# Altium schematic sheet Power.SchDoc
size A3; DrawnBy: Davut Beyazkaya; SheetNumber: 1; SheetTotal: 3; SPICEModelCacheTCAMPDML: <root> / <DocumentId>TCAMPDML</DocumentId> / <CacheFrame Number="0"> / <Model Name="3014_158301227" Kind="CKT"> / <Text>************************************************** / * Manufacturer:           Wurth Elektronik / * Kinds:                  SMT White Top view PLCC / * Matchcode:              WL-SWTP / * Library Type:           LTspice / * Version:                rev22a / * Created/modified by:    Ella / * Date and Time:          2022-03-02 / * Team:                   eiSos EDA Service / * Contact:                libraries@we-online.com / ************************************************** / * Copyright(C) 2022 WÃ¼rth Elektronik eiSos GmbH &amp; Co. KG / * All Rights Reserved. / ************************************************** / * Disclaimer: While WÃ¼rth Elektronik eiSos has made every reasonable effort to ensure the accuracy / * of the simulation models provided, WÃ¼rth Elektronik eiSos does not guarantee the exemption of error on / * the simulation models, nor does WÃ¼rth Elektronik eiSos guarantee that the simulation model is current. / * WÃ¼rth Elektronik eiSos reserves the right to make any adjustments at any time without notice. / * WÃ¼rth Elektronik eiSos expressly disclaims all implied warranties regarding this simulation model. / ************************************************** / .subckt 3014_158301227  1  2 / D1 1 2 led / .MODEL led D / + IS=91.819E-12 / + N=4.0378 / + RS=11.199E-6 / + IKF=1.1025E-6 / + CJO=1.0000E-12 / + M=.3333 / + VJ=.75 / + BV=5 / + IBV=5.00E-6 / + TT=5.0000E-9 / .ends</Text> / </Model> / <Model Name="1260_744771115_15u" Kind="CKT"> / <Text>******* / .subckt 1260_744771115_15u 1 2 / Rp 1 2 13381 / Cp 1 2 6.382p / Rs 1 N3 0.022 / L1 N3 2 12.996u / .ends 1260_744771115_15u</Text> / </Model> / </CacheFrame> / </root>
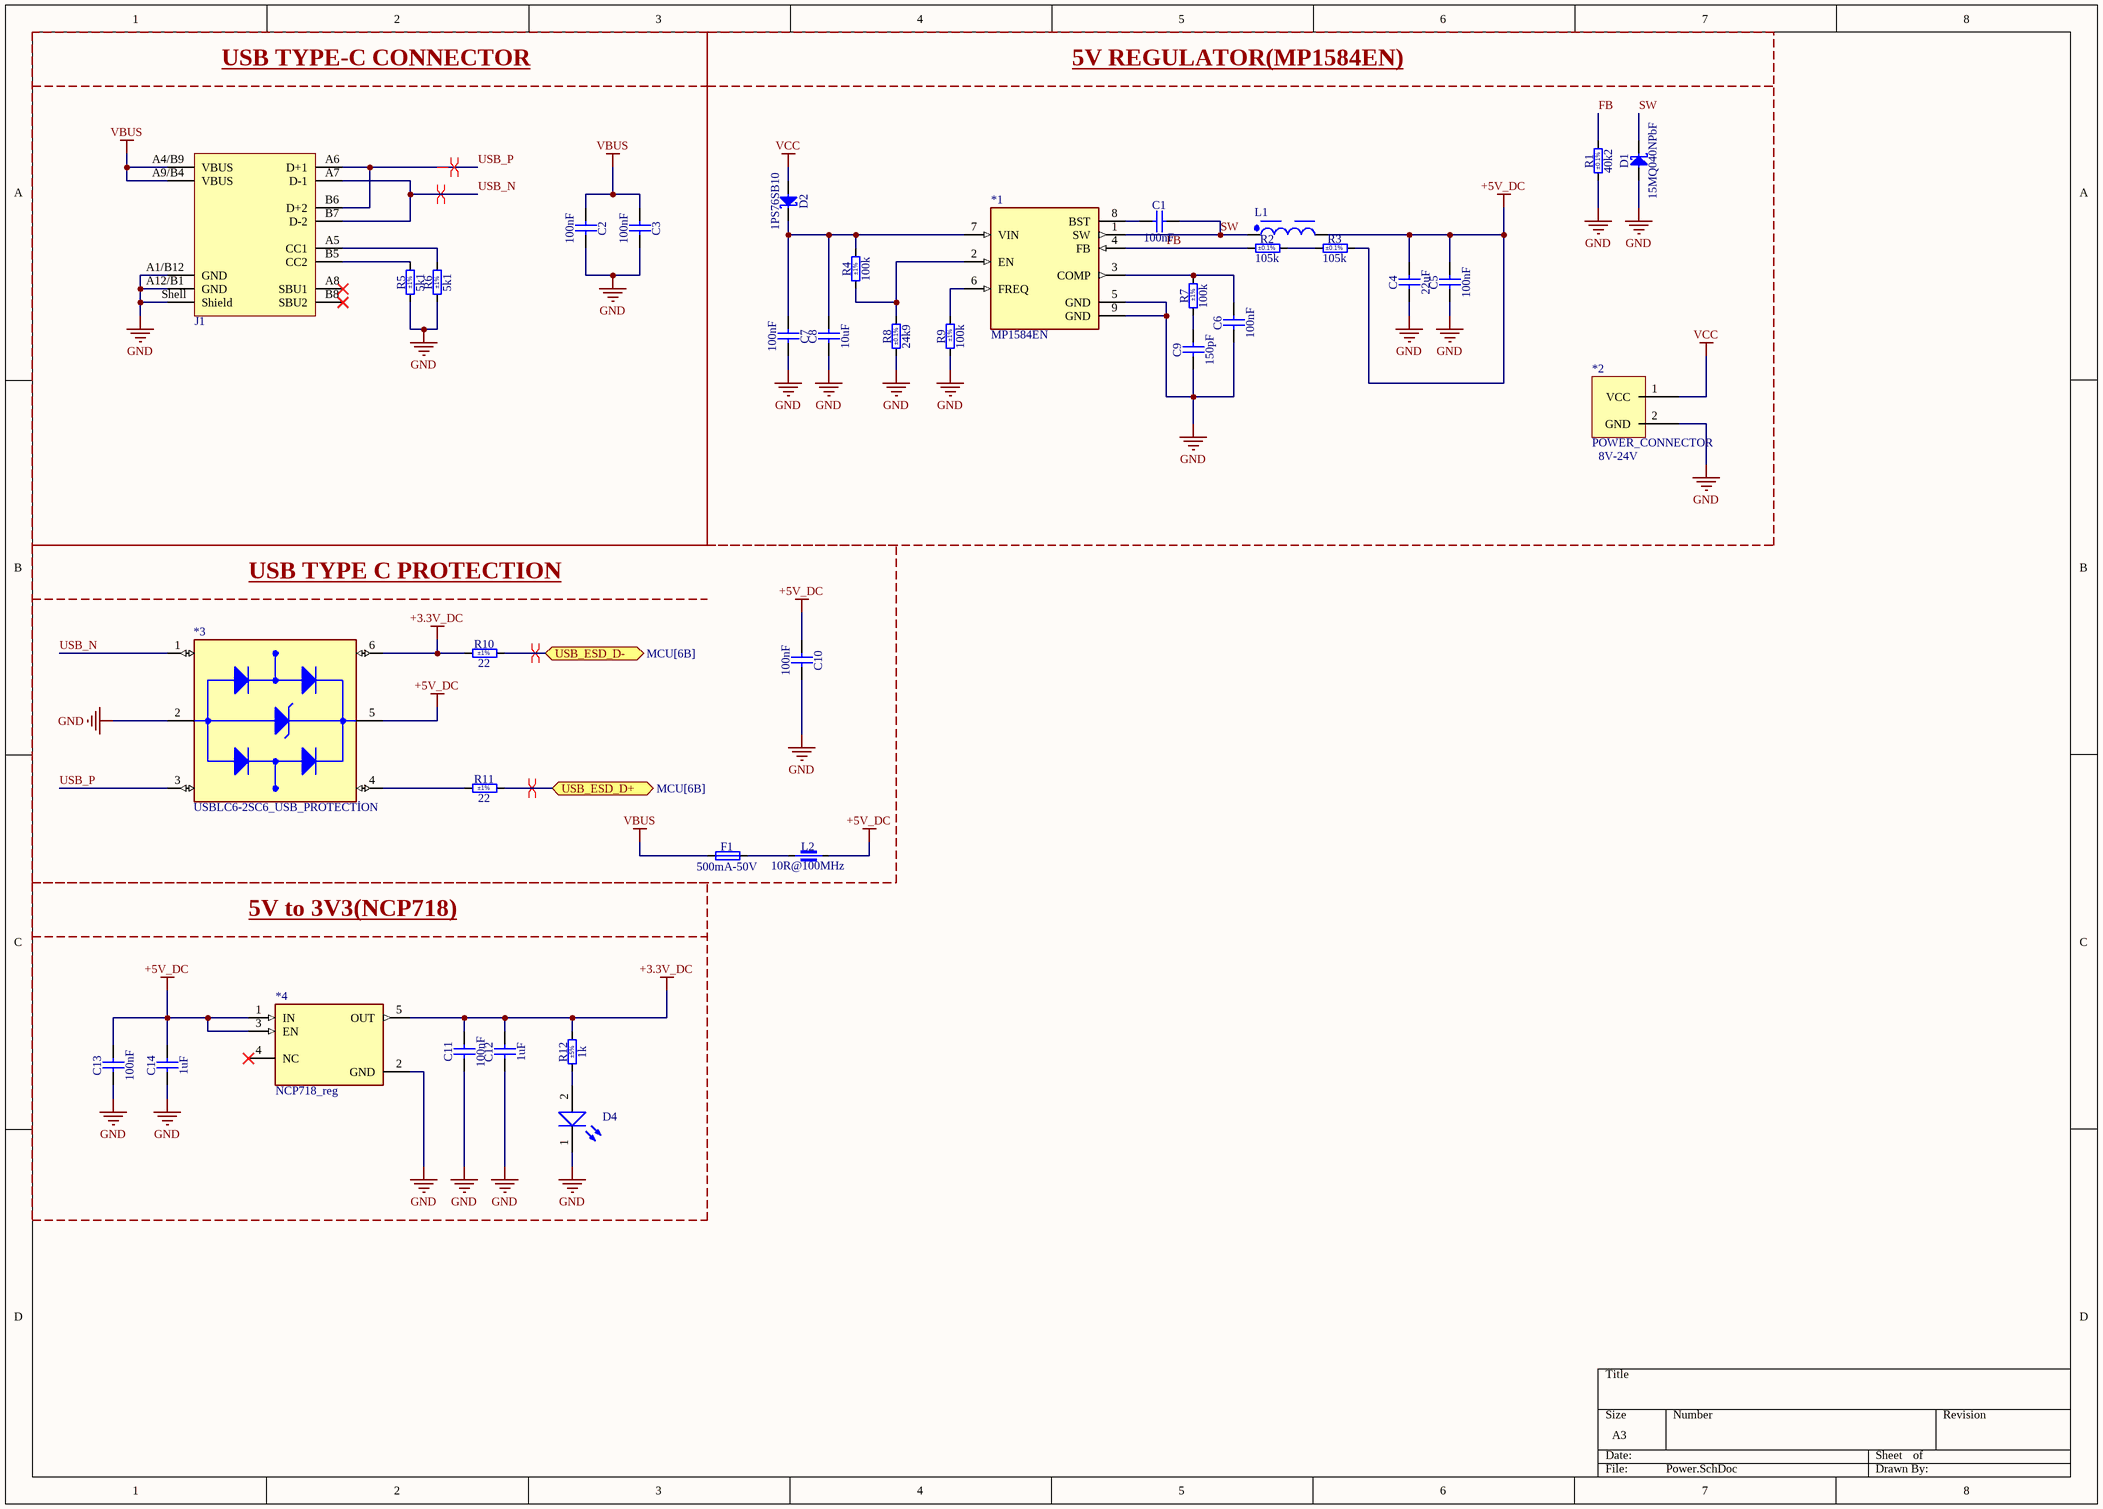
[diagram p0: Power.SchDoc]

## Parts
*1  MP1584EN  [MP1584EN]
*2  POWER_CONNECTOR  [POWER_CONNECTOR_lion_batt]
*3  USBLC6-2SC6_USB_PROTECTİON  [USBLC6-2SC6_USB_PROTECTION]
*4  NCP718_reg  [NCP718_reg]
C1  100nF  [CAPC2012X135N]
C2  100nF  [CAPC2012X135N]
C3  100nF  [CAPC2012X135N]
C4  22uF  [CAPC2012X135N]
C5  100nF  [CAPC2012X135N]
C6  100nF  [CAPC2012X135N]
C7  100nF  [CAPC2012X135N]
C8  10uF  [CAPC2012X145N]
C9  150pF  [CAPC2012X135N]
C10  100nF  [CAPC2012X135N]
C11  100nF  [CAPC2012X135N]
C12  1uF  [CAPC2012X140N]
C13  100nF  [CAPC2012X135N]
C14  1uF  [CAPC2012X140N]
D1  15MQ040NPbF  [DIOM5027X244N]
D2  1PS76SB10  [SOD2512X110N]
D4  Sunrise, 3V, 120°  [WL-SWTP_3014_L3W1.4H0.8]  (value not drawn)
F1  500mA-50V  [FUSC_BOURNS_SF-0603F]
J1  629722000214  [629722000214]  (value not drawn)
L1  15uH, 4.2A  [WE-PD_1260]  (value not drawn)
L2  10R@100MHz  [INDC1608X95N]
R1  40k2  Tolerance: ±0.1%  [RESC2012X60N]
R2  105k  Tolerance: ±0.1%  [RESC2012X60N]
R3  105k  Tolerance: ±0.1%  [RESC2012X60N]
R4  100k  Tolerance: ±1%  [RESC2012X60N]
R5  5k1  Tolerance: ±1%  [RESC2012X60N]
R6  5k1  Tolerance: ±1%  [RESC2012X60N]
R7  100k  Tolerance: ±1%  [RESC2012X60N]
R8  24k9  Tolerance: ±0.1%  [RESC2012X60N]
R9  100k  Tolerance: ±1%  [RESC2012X60N]
R10  22  Tolerance: ±1%  [RESC2012X60N]
R11  22  Tolerance: ±1%  [RESC2012X60N]
R12  1k  Tolerance: ±5%  [RESC2012X60N]

## Blocks framed on the sheet
USB TYPE-C CONNECTOR: C2 C3 J1 R5 R6
5V REGULATOR(MP1584EN): *1 *2 C1 C4-C9 D1 D2 L1 R1-R4 R7-R9
USB TYPE C PROTECTION: *3 C10 F1 L2 R10 R11
5V to 3V3(NCP718): *4 C11-C14 D4 R12

## Ports
USB_ESD_D+ (bidir, see MCU[6B]), USB_ESD_D- (bidir, see MCU[6B])

## Nets
+3.3V_DC: *3.6(I/O1_OUT) *4.5(OUT) C11.2 C12.2 R10.1 R12.2
+5V_DC: *3.5(VBUS) *4.1(IN) *4.3(EN) C4.2 C5.2 C10.1 C13.2 C14.2 L1.2 L2.2 R3.2
GND: *1.5(GND) *1.9(GND) *2.2(GND) *3.2(GND) *4.2(GND) C2.2 C3.2 C4.1 C5.1 C6.1 C7.2 C8.1 C9.1 C10.2 C11.1 C12.1 C13.1 C14.1 D1.2(A) D4.1(K) J1.A1/B12(GND) J1.A12/B1(GND) J1.Shell(Shield) R1.1 R5.1 R6.1 R8.1 R9.1
VBUS: C2.1 C3.1 F1.1 J1.A4/B9(VBUS) J1.A9/B4(VBUS)
VCC: *2.1(VCC) D2.2(A)
FB: *1.4(FB) R1.2 R2.1
SW: *1.1(SW) C1.2 D1.1(C) L1.1
USB_ESD_D+: R11.2 ; port USB_ESD_D+
USB_ESD_D-: R10.2 ; port USB_ESD_D-
USB_N: *3.1(I/O1_IN) J1.A7(D-1) J1.B7(D-2)
USB_P: *3.3(I/O2_IN) J1.A6(D+1) J1.B6(D+2)
Net*1_2: *1.2(EN) R4.1 R8.2
Net*1_3: *1.3(COMP) C6.2 R7.2
Net*1_6: *1.6(FREQ) R9.2
Net*1_7: *1.7(VIN) C7.1 C8.2 D2.1(C) R4.2
Net*1_8: *1.8(BST) C1.1
Net*3_4: *3.4(I/O2_OUT) R11.1
NetC9_2: C9.2 R7.1
NetD4_2: D4.2(A) R12.1
NetF1_2: F1.2 L2.1
NetJ1_A5: J1.A5(CC1) R6.2
NetJ1_B5: J1.B5(CC2) R5.2
NetR2_2: R2.2 R3.1

Not connected (* = marked no-connect by the designer): *4 4(NC)*; J1 A8(SBU1)* B8(SBU2)*

## Layout directives
differential pair: USB_ESD_D+, USB_ESD_D-, USB_N, USB_P

## Notes on the sheet
- (near *2) 8V-24V

## Library data of the parts
*2 = POWER_CONNECTOR_lion_batt
C1-C3 C5-C7 C10 C11 C13 = CC0805_100NF_50V_10%_X7R: Non-polarised capacitor; Part Description: SMD Multilayer Chip Ceramic Capacitor; Manufacturer: GENERIC; Manufacturer1 Part Number: C2012X7R1H104K085; Voltage: 50V; TC: X7R; Tolerance: ±10%; Part Number: CC0805_100NF_50V_10%_X7R; Component Kind: Standard; Component Type: Standard; Pin Count: 2; Value: 100nF; Status: None; Manufacturer Part Number: CC0805_100NF_50V_10%_X7R; Case: 0805; Mounted: Yes; Socket: No; SMD: Yes; Sense: No; Manufacturer1 Example: TDK; Manufacturer1 ComponentHeight: 1mm; HelpURL: \\cern.ch\dfs\Applications\Altium\Datasheets\CC0805_X7R_TDK_C.pdf; Author: CERN DEM JLC; CreateDate: 3.12.2007; LatestRevisionDate: 22.04.2015
C4 = CC0805_22UF_16V_10%_X5R: Non-polarised capacitor; Part Description: SMD Multilayer Chip Ceramic Capacitor; Manufacturer: GENERIC; Manufacturer1 Part Number: C2012X5R1C226KT; Voltage: 16V; TC: X5R; Tolerance: ±10%; Part Number: CC0805_22UF_16V_10%_X5R; Component Kind: Standard; Component Type: Standard; Pin Count: 2; Value: 22uF; Status: Preferred; Manufacturer Part Number: CC0805_22UF_16V_10%_X5R; Case: 0805; Mounted: Yes; Socket: No; SMD: Yes; Sense: No; Manufacturer1 Example: TDK; Manufacturer1 ComponentHeight: 1.35mm; HelpURL: \\cern.ch\dfs\Applications\Altium\Datasheets\CC0805_X5R_TDK_C.pdf; Author: CERN DEM JLC; CreateDate: 25.10.2012; LatestRevisionDate: 25.10.2012
C8 = CC0805_10UF_25V_10%_X5R_YUDEN_TMK212BBJ106KGHT: Non-polarised capacitor; Part Description: SMD Multilayer Chip Ceramic Capacitor (High Dielectric Type) for Automotive / Industrial Applications; Manufacturer: TAIYO YUDEN; Voltage: 25V; TC: X5R; Tolerance: ±10%; Part Number: CC0805_10UF_25V_10%_X5R_YUDEN_TMK212BBJ106KGHT; Component Kind: Standard; Component Type: Standard; Pin Count: 2; Value: 10uF; Status: Not Recommended; Manufacturer Part Number: TMK212BBJ106KGHT; Case: 0805; Mounted: Yes; Socket: No; SMD: Yes; Sense: No; ComponentHeight: 1.45mm; HelpURL: \\cern.ch\dfs\Applications\Altium\Datasheets\CC0805_TAIYO-YUDEN_TMK212BBJ106KGHT.pdf; Author: CERN DEM JLC; CreateDate: 23.01.2018; LatestRevisionDate: 23.01.2018
C9 = CC0805_150PF_50V_5%_C0G: Non-polarised capacitor; Part Description: SMD Multilayer Chip Ceramic Capacitor; Manufacturer: GENERIC; Manufacturer1 Part Number: C0805C151J5GACTU; Voltage: 50V; TC: C0G/NP0; Tolerance: ±5%; Part Number: CC0805_150PF_50V_5%_C0G; Component Kind: Standard; Component Type: Standard; Pin Count: 2; Value: 150pF; Status: Preferred; Manufacturer Part Number: CC0805_150PF_50V_5%_C0G; Case: 0805; Mounted: Yes; Socket: No; SMD: Yes; Sense: No; Manufacturer1 Example: KEMET; Manufacturer1 ComponentHeight: 0.88mm; HelpURL: \\cern.ch\dfs\Applications\Altium\Datasheets\CC0805_C0G_KEMET_(Commercial Grade).pdf; Author: CERN DEM JLC; CreateDate: 3.12.2007; LatestRevisionDate: 22.04.2015
C12 C14 = CC0805_1UF_35V_20%_X7R: Non-polarised capacitor; Part Description: SMD Multilayer Chip Ceramic Capacitor; Manufacturer: GENERIC; Manufacturer1 Part Number: GMK212B7105MG-T; Voltage: 35V; TC: X7R; Tolerance: ±20%; Part Number: CC0805_1UF_35V_20%_X7R; Component Kind: Standard; Component Type: Standard; Pin Count: 2; Value: 1uF; Status: Not Recommended; Manufacturer Part Number: CC0805_1UF_35V_20%_X7R; Case: 0805; Mounted: Yes; Socket: No; SMD: Yes; Sense: No; Manufacturer1 Example: TAIYO YUDEN; Manufacturer1 ComponentHeight: 1.35mm; HelpURL: \\cern.ch\dfs\Applications\Altium\Datasheets\CC0805_X7R_TAIYO-YUDEN_HIGH-VALUE.pdf; Author: CERN DEM JLC; CreateDate: 22.06.2011; LatestRevisionDate: 22.06.2011
D1 = 15MQ040NPbF: Schottky Diode; Part Description: Schottky Rectifier; Manufacturer: VISHAY INTERTECHNOLOGY, INC.; Voltage: 40V; Power: 3A; PressFit: No; Bonding: No; Part Number: 15MQ040NPbF; Component Kind: Standard; Component Type: Standard; Device: 15MQ040NPbF; PackageDescription: DO-214-AC/SMA  Molded Diode, Body 5.0x2.7mm, IPC Medium Density; Status: Obsolete; Manufacturer Part Number: 15MQ040N; Pin Count: 2; Case: DO-214AC; Mounted: Yes; Socket: No; SMD: Yes; Sense: No; ComponentHeight: 2.44mm; HelpURL: \\cern.ch\dfs\Applications\Altium\Datasheets\15MQ040NPbF.pdf; Author: CERN DEM JLC; CreateDate: 9.03.2009; LatestRevisionDate: 9.06.2022
D2 = 1PS76SB10: Schottky Diode; Part Description: Schottky Barrier Single Diode; Manufacturer: NXP SEMICONDUCTORS; Voltage: 30V; Power: 200mA; PressFit: No; Bonding: No; Part Number: 1PS76SB10; Component Kind: Standard; Component Type: Standard; Device: 1PS76SB10; PackageDescription: Small Outline Diode (SOD-323), 1.70mm W X 1.25mm L X 1.10mm H body,  IPC Medium Density; Manufacturer Part Number: 1PS76SB10; Pin Count: 2; Case: SOD-323; Mounted: Yes; Socket: No; SMD: Yes; Sense: No; ComponentHeight: 1.1mm; HelpURL: \\cern.ch\dfs\Applications\Altium\Datasheets\1PS76SB10.pdf; Author: CERN DEM JLC; CreateDate: 6.12.2012; LatestRevisionDate: 6.12.2012
D4 = 158301227: WL-SWTP SMT White Top view PLCC, size 3014, Sunrise, 3V, 120°; Manufacturer: Wurth Elektronik; Case/Size Code: 3014; Chip Technology: InGaN; Color Rendering Index: 85; Correlated Color Temperature: 2700K; Luminous Flux: 8lm; Manufacturer Part Number: 158301227; Category: General Lighting; Match Code: WL-SWTP; ComponentLink1Description: Website Link; ComponentLink1URL: https://www.we-online.com/redexpert/article/158301227?ad; ComponentLink2Description: Datasheet Link; ComponentLink2URL: https://www.we-online.com/redexpert/spec/158301227?ad; Mount: Surface Mount; Operating Temperature Max: 85°C; Operating Temperature Min: -40°C; Packaging: Tape and Reel; Length: 3mm; Width: 1.4mm; Height: 0.8mm; Emitting Color: Sunrise; Forward Voltage: 3V; Viewing Angle: 120°
F1 = FUS0603_BOURNS-SF-0603F050-2: Fuse; Part Description: Fast Acting Thin Film Chip Fuse for Overcurrent Protection, SinglFuse™ SF-0603F  Series; Manufacturer: BOURNS; PressFit: No; Part Number: FUS0603_BOURNS-SF-0603F050-2; Component Kind: Standard; Component Type: Standard; Pin Count: 2; Case: 0603; PackageDescription: Chip Fuse, 2-Leads, Body 1.6mm x 0.8mm, IPC Medium Density; Family: Fuse; Mounted: Yes; Socket: No; SMD: Yes; Sense: No; Value: 500mA-50V; Manufacturer Part Number: SF-0603F050-2; ComponentHeight: 0.55mm; HelpURL: \\cern.ch\dfs\Applications\Altium\Datasheets\FUSC_BOURNS_SF-0603F.pdf; Author: CERN DEM JLC; CreateDate: 1.02.2017; LatestRevisionDate: 1.02.2017
J1 = 629722000214: WR-COM USB 2.0 Type C Receptacle Horizontal SMT; Manufacturer: Wurth Elektronik; Match Code: WR-USB; Interface Type: Type C; Number of Ports: 1; Rated Current: 5A; Working Voltage: 20V (DC); Manufacturer Part Number: 629722000214; Category: Input/Output Connectors; ComponentLink1Description: Website Link; ComponentLink1URL: https://www.we-online.com/redexpert/article/629722000214?ad; ComponentLink2Description: Datasheet Link; ComponentLink2URL: https://www.we-online.com/redexpert/spec/629722000214?ad; Mount: Surface Mount; Operating Temperature Max: 85°C; Operating Temperature Min: -40°C; Packaging: Tape and Reel; Application: USB 2.0; Gender: Receptacle; Number of Pins: 16; Orientation: Horizontal
L1 = 744771115: WE-PD SMT Power Inductor, size 1260, 15uH, 4.2A, 28mOhm; Manufacturer: Wurth Elektronik; Case/Size Code: 1260; DC Resistance: 22mOhm; Saturation Current: 4.5A; Self Resonant Frequency: 16.6MHz; Type: Standard; Manufacturer Part Number: 744771115; Category: Power Inductors; Match Code: WE-PD; ComponentLink1Description: Website Link; ComponentLink1URL: https://www.we-online.com/redexpert/article/744771115?ad; ComponentLink2Description: Datasheet Link; ComponentLink2URL: https://www.we-online.com/redexpert/spec/744771115?ad; Mount: Surface Mount; Operating Temperature Max: 125°C; Operating Temperature Min: -40°C; Packaging: Tape and Reel; Length: 12mm; Width: 12mm; Height: 6mm; DC Resistance Max: 28mOhm; Inductance: 15uH; Rated Current: 4.2A
L2 = IND0603_MURATA_BLM18BA100SN1D: Part Description: SMD EMIFIL Suppression Chip Ferrite Bead; Manufacturer: MURATA; Power: 500mA; Resistance: 0.25R; Tolerance: ±25%; Part Number: IND0603_MURATA_BLM18BA100SN1D; Component Kind: Standard; Component Type: Standard; Pin Count: 2; Value: 10R@100MHz; Manufacturer Part Number: BLM18BA100SN1D; Case: 0603; Mounted: Yes; Socket: No; SMD: Yes; Sense: No; ComponentHeight: 0.95mm; HelpURL: \\cern.ch\dfs\Applications\Altium\Datasheets\IND0603_MURATA_BLM18B.pdf; Author: CERN DEM JLC; CreateDate: 13.01.2014; LatestRevisionDate: 25.10.2018
R1 = R0805_40K2_0.1%_0.125W_15PPM: Resistor - 0.1%; Part Description: Thin Film Chip Resistor; Manufacturer: GENERIC; Manufacturer1 Part Number: RP73D2A40K2BTG; Power: 0.125W; TC: ±15ppm/°C; PressFit: No; Part Number: R0805_40K2_0.1%_0.125W_15PPM; Component Kind: Standard; Component Type: Standard; Pin Count: 2; Value: 40k2; Status: Not Recommended; Manufacturer Part Number: R0805_40K2_0.1%_0.125W_15PPM; Case: 0805; Mounted: Yes; Sense: No; Socket: No; SMD: Yes; Manufacturer1 Example: TYCO ELECTRONICS; Manufacturer1 ComponentHeight: 0.65mm; HelpURL: \\cern.ch\dfs\Applications\Altium\Datasheets\R0805_TYCO_RP73.pdf; Author: CERN DEM JLC; CreateDate: 5.03.2015; LatestRevisionDate: 28.06.2022
R2 R3 = R0805_105K_0.1%_0.1W_10PPM: Resistor - 0.1%; Part Description: Thin Film Chip Resistor; Manufacturer: GENERIC; Manufacturer1 Part Number: RN73C2A105KBTG; Power: 0.1W; TC: ±10ppm; PressFit: No; Part Number: R0805_105K_0.1%_0.1W_10PPM; Component Kind: Standard; Component Type: Standard; Pin Count: 2; Value: 105k; Status: Not Recommended; Manufacturer Part Number: R0805_105K_0.1%_0.1W_10PPM; Case: 0805; Mounted: Yes; Sense: No; Socket: No; SMD: Yes; Manufacturer1 Example: TYCO HOLSWORTHY; Manufacturer1 ComponentHeight: 0.6mm; HelpURL: \\cern.ch\dfs\Applications\Altium\Datasheets\R0805_Tyco_RN73.pdf; Author: CERN DEM JLC; CreateDate: 3.12.2007; LatestRevisionDate: 13.03.2008
R4 R7 R9 = R0805_100K_1%_0.125W_100PPM: Resistor - 1%; Part Description: General Purpose Thick Film Chip Resistor; Manufacturer: GENERIC; Manufacturer1 Part Number: NRC10F1003TRF; Power: 0.125W; TC: ±100ppm/°C; PressFit: No; Part Number: R0805_100K_1%_0.125W_100PPM; Component Kind: Standard; Component Type: Standard; Pin Count: 2; Value: 100k; Status: Preferred; Manufacturer Part Number: R0805_100K_1%_0.125W_100PPM; Case: 0805; Mounted: Yes; Sense: No; Socket: No; SMD: Yes; Manufacturer1 Example: NIC COMPONENT; Manufacturer1 ComponentHeight: 0.6mm; HelpURL: \\cern.ch\dfs\Applications\Altium\Datasheets\R0805_NIC_NRC.pdf; Author: CERN DEM JLC; CreateDate: 3.12.2007; LatestRevisionDate: 13.03.2008
R5 R6 = R0805_5K1_1%_0.125W_100PPM: Resistor - 1%; Part Description: General Purpose Thick Film Chip Resistor; Manufacturer: GENERIC; Manufacturer1 Part Number: NRC10F5101TRF; Power: 0.125W; TC: ±100ppm/°C; PressFit: No; Part Number: R0805_5K1_1%_0.125W_100PPM; Component Kind: Standard; Component Type: Standard; Pin Count: 2; Value: 5k1; Status: Preferred; Manufacturer Part Number: R0805_5K1_1%_0.125W_100PPM; Case: 0805; Mounted: Yes; Sense: No; Socket: No; SMD: Yes; Manufacturer1 Example: NIC COMPONENT; Manufacturer1 ComponentHeight: 0.6mm; HelpURL: \\cern.ch\dfs\Applications\Altium\Datasheets\R0805_NIC_NRC.pdf; Author: CERN DEM JLC; CreateDate: 3.12.2007; LatestRevisionDate: 13.03.2008
R8 = R0805_24K9_0.1%_0.1W_10PPM: Resistor - 0.1%; Part Description: Thin Film Chip Resistor; Manufacturer: GENERIC; Manufacturer1 Part Number: RN73C2A24K9BTG; Power: 0.1W; TC: ±10ppm; PressFit: No; Part Number: R0805_24K9_0.1%_0.1W_10PPM; Component Kind: Standard; Component Type: Standard; Pin Count: 2; Value: 24k9; Status: Not Recommended; Manufacturer Part Number: R0805_24K9_0.1%_0.1W_10PPM; Case: 0805; Mounted: Yes; Sense: No; Socket: No; SMD: Yes; Manufacturer1 Example: TYCO HOLSWORTHY; Manufacturer1 ComponentHeight: 0.6mm; HelpURL: \\cern.ch\dfs\Applications\Altium\Datasheets\R0805_Tyco_RN73.pdf; Author: CERN DEM JLC; CreateDate: 3.12.2007; LatestRevisionDate: 13.03.2008
R10 R11 = R0805_22R_1%_0.125W_100PPM: Resistor - 1%; Part Description: General Purpose Thick Film Chip Resistor; Manufacturer: GENERIC; Manufacturer1 Part Number: NRC10F22R0TRF; Power: 0.125W; TC: ±100ppm/°C; PressFit: No; Part Number: R0805_22R_1%_0.125W_100PPM; Component Kind: Standard; Component Type: Standard; Pin Count: 2; Value: 22; Status: Preferred; Manufacturer Part Number: R0805_22R_1%_0.125W_100PPM; Case: 0805; Mounted: Yes; Sense: No; Socket: No; SMD: Yes; Manufacturer1 Example: NIC COMPONENT; Manufacturer1 ComponentHeight: 0.6mm; HelpURL: \\cern.ch\dfs\Applications\Altium\Datasheets\R0805_NIC_NRC.pdf; Author: CERN DEM JLC; CreateDate: 3.12.2007; LatestRevisionDate: 13.03.2008
R12 = R0805_1K_0.1%_0.125W_25PPM: Resistor - 0.1%; Part Description: Thin Film Chip Resistor; Manufacturer: GENERIC; Manufacturer1 Part Number: ERA6AEB102V; Power: 0.125W; TC: ±25ppm; PressFit: No; Part Number: R0805_1K_0.1%_0.125W_25PPM; Component Kind: Standard; Component Type: Standard; Pin Count: 2; Value: 1k; Status: Not Recommended; Manufacturer Part Number: R0805_1K_0.1%_0.125W_25PPM; Case: 0805; Mounted: Yes; Sense: No; Socket: No; SMD: Yes; Manufacturer1 Example: PANASONIC; Manufacturer1 ComponentHeight: 0.6mm; HelpURL: \\cern.ch\dfs\Applications\Altium\Datasheets\R0805_PANASONIC_ERA.pdf; Author: CERN DEM JLC; CreateDate: 18.10.2010; LatestRevisionDate: 18.10.2010